# EAGLE design driver_board_one_module_pic_v3_1 (EAGLE 7.6.0)
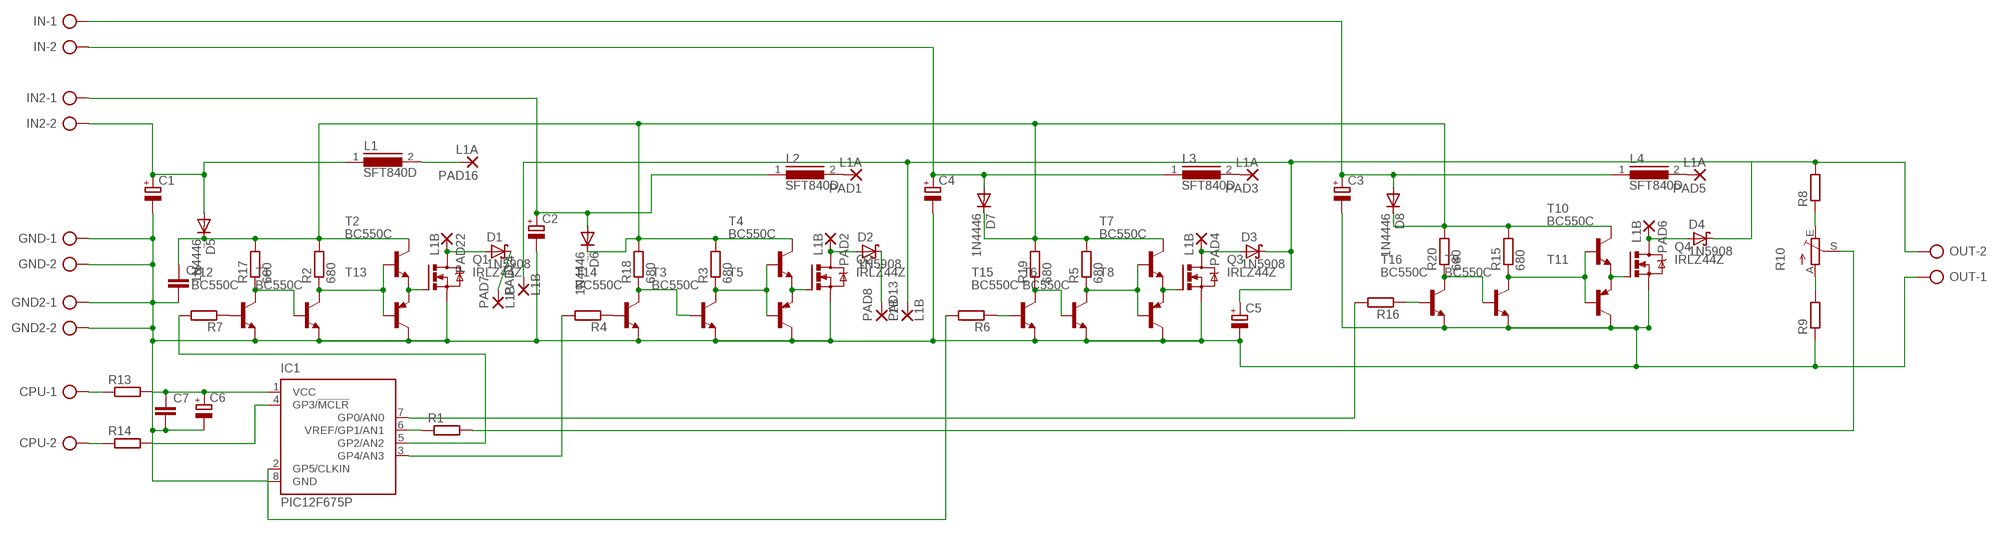
[diagram p0: schematic, sheet 1]

## Parts
C1  CPOL-EUE5-8.5  [E5-8,5]
C2  CPOL-EUE5-8.5  [E5-8,5]
C3  CPOL-EUE5-8.5  [E5-8,5]
C4  CPOL-EUE5-8.5  [E5-8,5]
C5  CPOL-EUE5-8.5  [E5-8,5]
C6  CPOL-EUE5-8.5  [E5-8,5]
C7  C-EUC1206K  [C1206K]
C8  C-EU050-045X075  [C050-045X075]
CPU  AK300/2  [AK300/2]
D1  1N5908  [C4111-15]
D2  1N5908  [C4111-15]
D3  1N5908  [C4111-15]
D4  1N5908  [C4111-15]
D5  1N4446  [DO35-10]
D6  1N4446  [DO35-10]
D7  1N4446  [DO35-10]
D8  1N4446  [DO35-10]
GND  AK300/2  [AK300/2]
GND2  AK300/2  [AK300/2]
IC1  PIC12F675P  [DIL8]
IN  AK300/2  [AK300/2]
IN2  AK300/2  [AK300/2]
L1  SFT840D  [SFT840D]
L2  SFT840D  [SFT840D]
L3  SFT840D  [SFT840D]
L4  SFT840D  [SFT840D]
OUT  AK300/2  [AK300/2]
PAD1  L1A  3,81/1,1  [3,81/1,1]
PAD2  L1B  3,81/1,1  [3,81/1,1]
PAD3  L1A  3,81/1,1  [3,81/1,1]
PAD4  L1B  3,81/1,1  [3,81/1,1]
PAD5  L1A  3,81/1,1  [3,81/1,1]
PAD6  L1B  3,81/1,1  [3,81/1,1]
PAD7  L1B  3,81/1,1  [3,81/1,1]
PAD8  L1B  3,81/1,1  [3,81/1,1]
PAD13  L1B  3,81/1,1  [3,81/1,1]
PAD14  L1B  3,81/1,1  [3,81/1,1]
PAD16  L1A  3,81/1,1  [3,81/1,1]
PAD22  L1B  3,81/1,1  [3,81/1,1]
Q1  IRLZ44Z  [TO220BH]
Q2  IRLZ44Z  [TO220BH]
Q3  IRLZ44Z  [TO220BH]
Q4  IRLZ44Z  [TO220BH]
R1  R-EU_0204/5  [0204/5]
R2  680  R-EU_0207/7  [0207/7]
R3  680  R-EU_0204/5  [0204/5]
R4  R-EU_0207/7  [0207/7]
R5  680  R-EU_0204/5  [0204/5]
R6  R-EU_0207/12  [0207/12]
R7  R-EU_0207/12  [0207/12]
R8  R-EU_0204/5  [0204/5]
R9  R-EU_0204/5  [0204/5]
R10  TRIM_EU-RJ9W  [RJ9W]
R13  R-EU_0204/5  [0204/5]
R14  R-EU_0204/5  [0204/5]
R15  680  R-EU_0204/5  [0204/5]
R16  R-EU_0207/10  [0207/10]
R17  680  R-EU_0204/5  [0204/5]
R18  680  R-EU_0204/5  [0204/5]
R19  680  R-EU_0204/5  [0204/5]
R20  680  R-EU_0204/5  [0204/5]
T1  BC550C  [TO92-EBC]
T2  BC550C  [TO92-EBC]
T3  BC550C  [TO92-EBC]
T4  BC550C  [TO92-EBC]
T5  BC557C-PNP-TO92-EBC  [TO92-EBC]
T6  BC550C  [TO92-EBC]
T7  BC550C  [TO92-EBC]
T8  BC557C-PNP-TO92-EBC  [TO92-EBC]
T9  BC550C  [TO92-EBC]
T10  BC550C  [TO92-EBC]
T11  BC557C-PNP-TO92-EBC  [TO92-EBC]
T12  BC550C  [TO92-EBC]
T13  BC557C-PNP-TO92-EBC  [TO92-EBC]
T14  BC550C  [TO92-EBC]
T15  BC550C  [TO92-EBC]
T16  BC550C  [TO92-EBC]

## Nets
GND: C1.- C2.- C3.- C4.- C5.- C6.- C7.2 C8.2 GND2.1 GND2.2 GND.1 GND.2 IC1.8(GND) OUT.1 Q1.S Q2.S Q3.S Q4.S R9.1 T1.E T3.E T5.C T6.E T8.C T9.E T11.C T12.E T13.C T14.E T15.E T16.E
N$1: Q1.G T2.E T13.E
N$2: IC1.7(GP0/AN0) R16.2
N$3: Q2.G T4.E T5.E
N$4: CPU.1 R13.1
N$5: R9.2 R10.A
N$6: R6.1 T15.B
N$7: CPU.2 R14.1
N$9: D2.A PAD2.1(P) Q2.D
N$10: R8.1 R10.E
N$11: L2.2 PAD1.1(P)
N$12: Q3.G T7.E T8.E
N$13: Q4.G T10.E T11.E
N$14: R7.1 T12.B
N$15: R1.2 R10.S
N$16: R17.1 T1.B T12.C
N$18: D3.A PAD4.1(P) Q3.D
N$19: R4.1 T14.B
N$20: R18.1 T3.B T14.C
N$21: L3.2 PAD3.1(P)
N$22: IC1.5(GP2/AN2) R7.2
N$23: IC1.3(GP4/AN3) R4.2
N$24: IC1.2(GP5/CLKIN) R6.2
N$25: C6.+ C7.1 IC1.1(VCC) R13.2
N$26: IC1.4(GP3/!MCLR) R14.2
N$27: IC1.6(VREF/GP1/AN1) R1.1
N$28: C1.+ D5.A IN2.2 L1.1
N$29: C2.+ D6.A IN2.1 L2.1
N$30: C4.+ D7.A IN.2 L3.1
N$31: D1.C PAD7.1(P)
N$32: R16.1 T16.B
N$33: L1.2 PAD16.1(P)
N$34: D1.A PAD22.1(P) Q1.D
N$35: R2.1 T1.C T2.B T13.B
N$36: D4.A PAD6.1(P) Q4.D
N$37: L4.2 PAD5.1(P)
N$38: R3.1 T3.C T4.B T5.B
N$39: C3.+ D8.A IN.1 L4.1
N$40: R5.1 T6.C T7.B T8.B
N$41: R15.1 T9.C T10.B T11.B
N$42: R19.1 T6.B T15.C
N$43: R20.1 T9.B T16.C
N$44: D2.C PAD8.1(P)
N$45: C8.1 D5.C D6.C D7.C D8.C R2.2 R3.2 R5.2 R15.2 R17.2 R18.2 R19.2 R20.2 T2.C T4.C T7.C T10.C
N$46: C5.+ D3.C D4.C OUT.2 PAD13.1(P) PAD14.1(P) R8.2

## Library data of the parts
C1-C6 = rcl:CPOL-EU: POLARIZED CAPACITOR, European symbol
C7 C8 = rcl:C-EU: CAPACITOR, European symbol
CPU GND GND2 IN IN2 OUT = con-ptr500:AK300/2: CONNECTOR; OC_FARNELL: unknown; OC_NEWARK: unknown
D1-D4 = diode:1N5908: DIODE schottky
D5-D8 = diode:1N4446: DIODE high speed (Philips)
IC1 = microchip:PIC12F675: 8-Pin FLASH-Based 8-Bit CMOS Microcontroller Precision Internal 4 MHz oscillator factory calibrated to ±1% Low Power Features: Standby Current: - 1 nA @ 2.0V, typical Operating Current: - 8.5µA @ 32 kHz, 2.0V, typical - 100µA @ 1 MHz, 2.0V, typical Watchdog Timer Current: - 300 nA @ 2.0V, typical Timer1 oscillator current: - 4µA @ 32 kHz, 2.0V, typical Analog-to-Digital Converter module: - 10-bit resolution - Programmable 4-channel input - Voltage reference input Source: http://www.microchip.com .. 41190E.pdf; MF: MICROCHIP; MPN: PIC12F675-E/P; OC_FARNELL: 9759018; OC_NEWARK: 92C4340
L1-L4 = inductors:SFT840D: INDUCTOR
PAD1-PAD8 PAD13 PAD14 PAD16 PAD22 = wirepad:3,81/1,1: THROUGH-HOLE PAD
Q1-Q4 = transistor-power:IRLZ44Z: N-Channel HEXFET® Power MOSFET Logic Level AUTOMOTIVE MOSFET Source: http://www.irf.com/product-info/datasheets/data/irlz44zpbf.pdf
R1-R9 R13-R15 R17-R20 = resistor:R-EU_: RESISTOR, European symbol
R10 = pot:TRIM_EU-: POTENTIOMETER
R16 = rcl:R-EU_: RESISTOR, European symbol
T1-T4 T6 T7 T9 T10 T12 T14-T16 = transistor-npn:BC550*: NPN Transistor
T5 T8 T11 T13 = transistor:*-PNP-: PNP Transistror

## Board
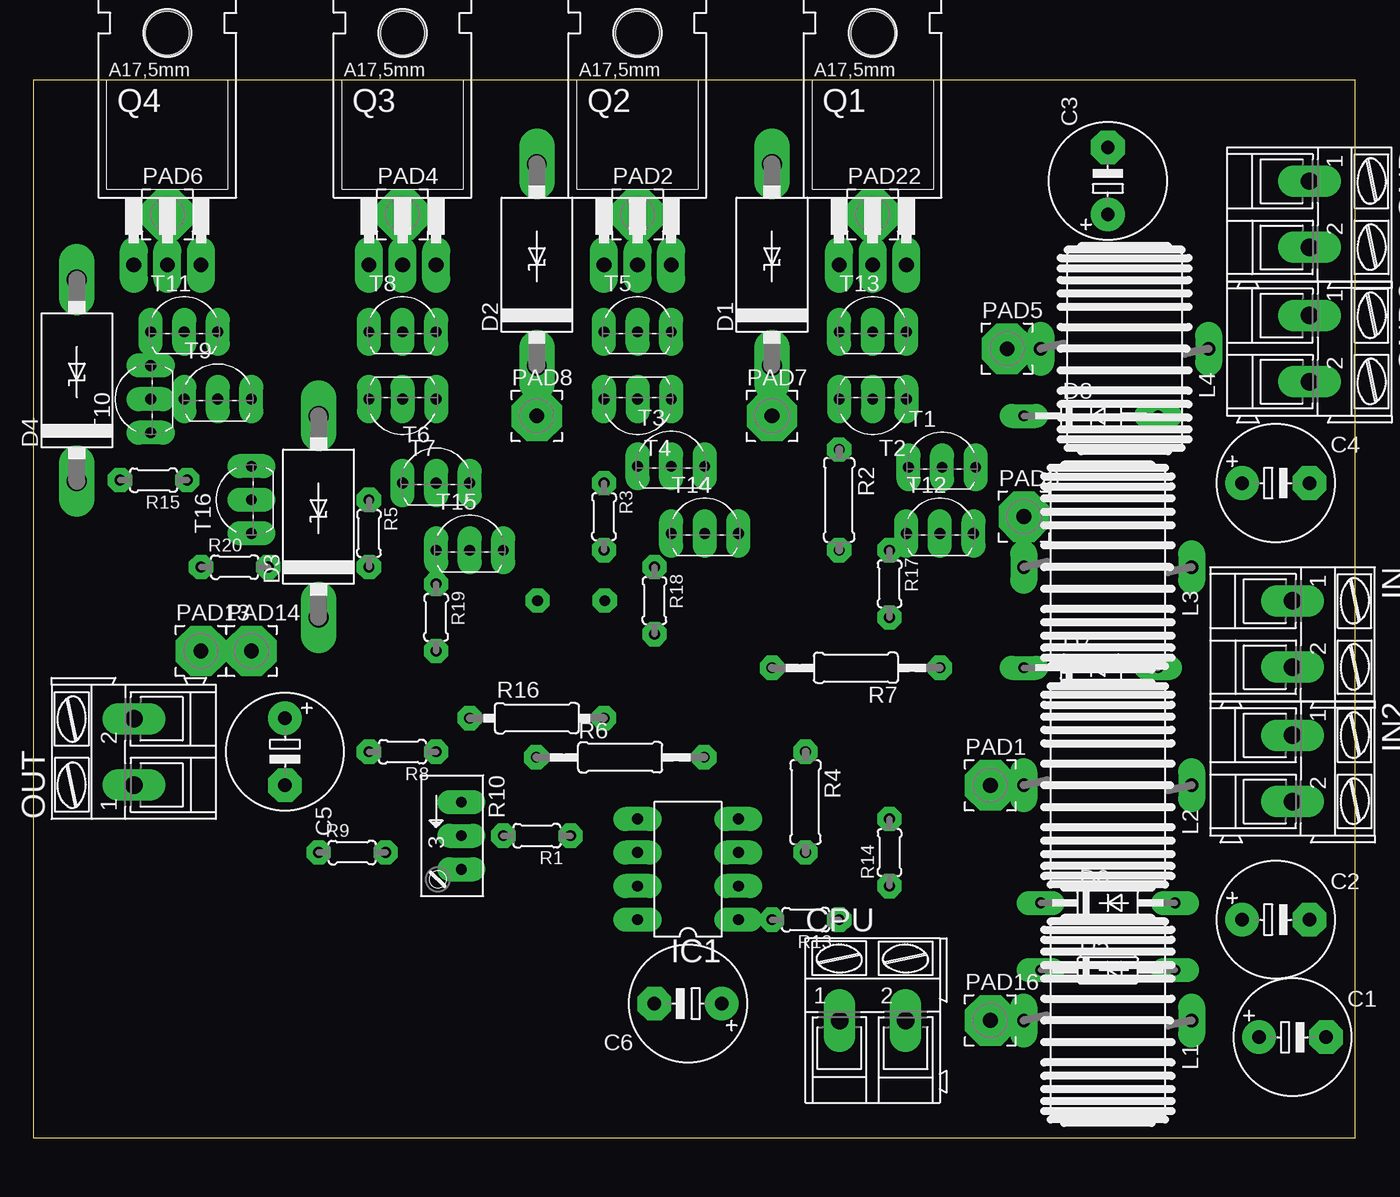
[diagram p1: board, top side]
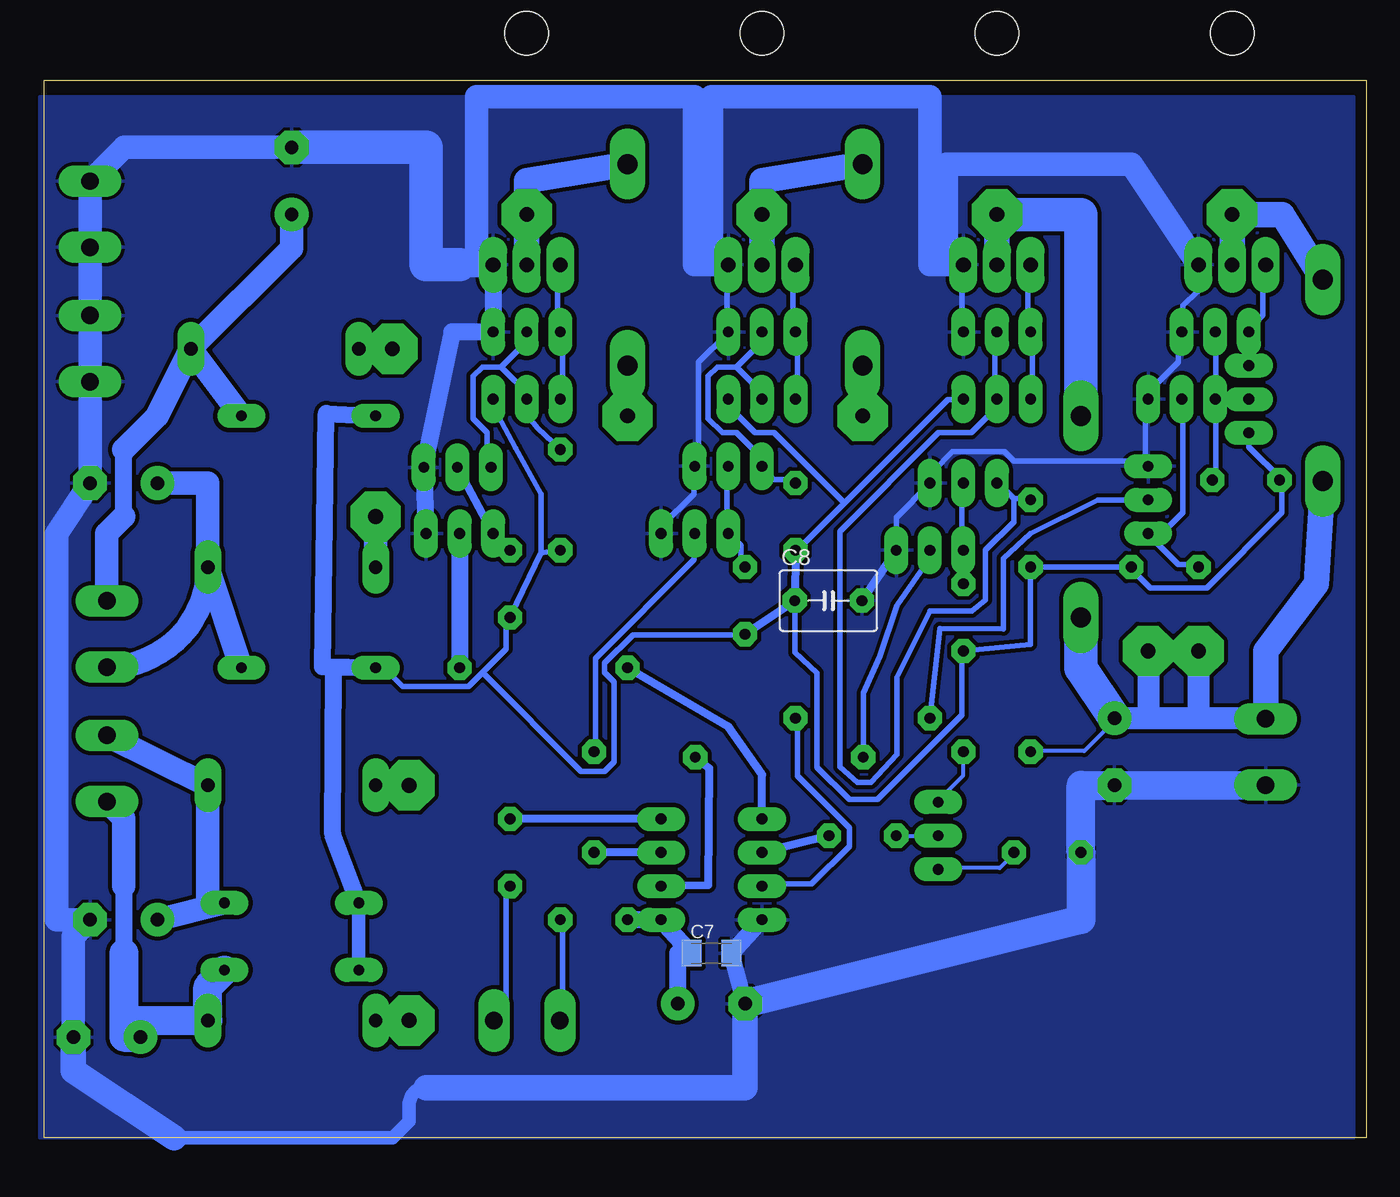
[diagram p2: board, bottom side, seen from below]

Size 100 x 80 mm. Coordinates in mm from the lower left corner, seen from the top.
Outline: 0,0 100,0 100,80 0,80 0,0
Copper layers (1*16): Top 0.035mm / dielectric 1.5mm / Bottom 0.035mm
Design rules "default *": minimum track width 16mil, minimum drill 24mil, track to track 12mil, track to pad 12mil, pad to pad 8mil, via to via 8mil, smd to smd 8mil, copper to edge 0mil, drill to drill 8mil, minimum pad ring 20mil, minimum via ring 8mil, stop-mask expansion 4mil, vias tented up to drill 0mil, thermal gap 10mil

### Footprints (pad centres in the part's own frame; a part is rotated, then mirrored left to right if it is on the bottom)
E5-8,5 = drill 1.016 pad 2.54: + -2.54,0 | drill 1.016 pad 2.54 octagon: - 2.54,0
C1206K = smd 1.5 x 2: 1 -1.5,0; 2 1.5,0
C050-045X075 = drill 0.813 octagon: 1 -2.54,0; 2 2.54,0
AK300/2 = drill 1.321 long: 1 -2.515,0; 2 2.489,0
C4111-15 = drill 1.499 long: A 7.62,0; C -7.62,0
DO35-10 = drill 0.813 long: A 5.08,0; C -5.08,0
DIL8 = drill 0.813 long: 1 -3.81,-3.81; 2 -1.27,-3.81; 3 1.27,-3.81; 4 3.81,-3.81; 5 3.81,3.81; 6 1.27,3.81; 7 -1.27,3.81; 8 -3.81,3.81
SFT840D = drill 1.016 long: 1 -6.35,0; 2 6.35,0
3,81/1,1 = drill 1.118 pad 3.81 octagon: 1 0,0
TO220BH = drill 1.118 long: D 0,-6.35; G -2.54,-6.35; S 2.54,-6.35 | hole 3.302: 0,11.176
0204/5 = drill 0.813 octagon: 1 -2.54,0; 2 2.54,0
0207/7 = drill 0.813 octagon: 1 -3.81,0; 2 3.81,0
0207/12 = drill 0.813 octagon: 1 -6.35,0; 2 6.35,0
RJ9W = drill 0.813 long: A 2.54,0.635; E -2.54,0.635; S 0,0.635
0207/10 = drill 0.813 octagon: 1 -5.08,0; 2 5.08,0
TO92-EBC = drill 0.813 long: B 0,-1.27; C -2.54,-1.27; E 2.54,-1.27
TO92-EBC' = drill 0.813 long: B 0,-1.27; C 2.54,-1.27; E -2.54,-1.27

### Placement (x,y rotation side)
C1  95.25,7.62 0 top
C2  93.98,16.51 0 top
C3  81.28,72.39 90 top
C4  93.98,49.53 0 top
C5  19.05,29.21 270 top
C6  49.53,10.16 180 top
C7  49.53,13.97 0 bottom
C8  40.69,40.64 0 bottom
CPU  63.5,8.89 0 top
D1  55.88,66.04 90 top
D2  38.1,66.04 90 top
D3  21.59,46.99 90 top
D4  3.31,57.3 90 top
D5  81.28,12.7 0 top
D6  81.28,17.78 0 top
D7  80.01,35.56 0 top
D8  80.01,54.61 0 top
GND  96.52,69.85 270 top
GND2  96.52,59.69 270 top
IC1  49.53,20.32 90 top
IN  95.25,38.1 270 top
IN2  95.25,27.94 270 top
L1  81.28,8.89 180 top
L2  81.28,26.67 180 top
L3  81.28,43.18 180 top
L4  82.55,59.69 180 top
OUT  7.62,29.21 90 top
PAD1  72.39,26.67 0 top
PAD2  45.72,69.85 0 top
PAD3  74.93,46.99 0 top
PAD4  27.94,69.85 0 top
PAD5  73.66,59.69 0 top
PAD6  10.16,69.85 0 top
PAD7  55.88,54.61 0 top
PAD8  38.1,54.61 0 top
PAD13  12.7,36.83 0 top
PAD14  16.51,36.83 0 top
PAD16  72.39,8.89 0 top
PAD22  63.5,69.85 0 top
Q1  63.5,72.39 0 top
Q2  45.72,72.39 0 top
Q3  27.94,72.39 0 top
Q4  10.16,72.39 0 top
R1  38.1,22.86 180 top
R2  60.96,48.26 270 top
R3  43.18,46.99 270 top
R4  58.42,25.4 270 top
R5  25.4,45.72 270 top
R6  44.4,28.79 0 top
R7  62.23,35.56 180 top
R8  27.94,29.21 180 top
R9  24.13,21.59 0 top
R10  31.75,22.86 270 top
R13  58.42,16.51 180 top
R14  64.77,21.59 90 top
R15  9.11,49.75 180 top
R16  38.1,31.75 0 top
R17  64.77,41.91 270 top
R18  46.99,40.64 270 top
R19  30.48,39.37 270 top
R20  15.24,43.18 0 top
T1  68.75,51.99 0 top
T2  63.5,54.61 180 top
T3  48.26,52.07 0 top
T4  45.72,54.61 180 top
T5  [TO92-EBC']  45.72,62.23 0 top
T6  30.48,50.8 0 top
T7  27.94,54.61 180 top
T8  [TO92-EBC']  27.94,62.23 0 top
T9  13.97,57.15 0 top
T10  7.62,55.88 90 top
T11  [TO92-EBC']  11.43,62.23 0 top
T12  68.58,46.99 0 top
T13  [TO92-EBC']  63.5,62.23 0 top
T14  50.8,46.99 0 top
T15  33.02,45.72 0 top
T16  15.24,48.26 90 top

### Tracks (layer width: path | path; a pad name or v marks a point on that pad's centre or on a via)
GND
  Bottom 0.305: 12.75,63.96 Q4.S
  Bottom 0.406: Q4.S 12.8,64.01 13.87,62.94 13.87,61.16 T11.C 14.22,60.81 14.22,58.67 16.71,56.19 T9.E 16.71,55.83 16.71,51.21 | 16.71,51.21 16.71,50.85 T16.E 16.71,51.21 | 16.71,51.21 26.67,51.21 27.38,51.92 31.29,51.92 32.72,50.49 32.72,49.78 T6.E 33.07,49.43 35.56,46.94 T15.E | T14.E 53.34,46.23 50.85,48.72 50.85,50.49 T3.E 50.49,50.85 50.49,58.67 48.36,60.81 T5.C 48.36,61.16 48.36,65.43 Q2.S | T8.C 30.58,61.16 30.58,65.43 Q3.S
  Bottom 0.61: T15.E C8.2
  Bottom 1.016: 71.12,3.81 arc-90 72.39,2.54 72.39,1.27 73.66,0 90.17,0
  Bottom 1.27: C6.- C7.2 IC1.8 | Q1.S T13.C 69.16,60.95 T1.E T12.E
  Bottom 1.778: Q4.S 17.78,73.66 31.75,73.66 31.75,66.04 Q3.S 33.02,66.04 33.02,78.74 49.53,78.74 49.53,66.04 Q2.S 50.8,66.04 50.8,78.74 67.31,78.74 67.31,66.04 | C3.- 93.95,74.93 GND.1 GND.2 GND2.1 GND2.2 C4.- 99.06,45.72 99.06,16.51 C2.- 97.79,15.24 C1.-
  Bottom 1.93: Q1.S 67.31,66.04 68.58,66.04 | C6.- 46.99,3.81 71.12,3.81 | 90.17,0 97.79,5.08 C1.-
  Bottom 2.184: C6.- 21.59,16.51 R9.1 21.59,26.67 C5.- OUT.1
  Bottom 2.54: 68.58,66.04 71.12,66.04 71.12,74.93 C3.-
  pour Bottom (isolate 0.305): 0.96,78.74 0.96,0 100.33,0 100.33,78.74
N$1
  Bottom 0.406: T2.E 60.81,56.19 60.81,60.81 T13.E 61.16,61.16 61.16,65.79 Q1.G
N$2
  Bottom 0.406: R16.2 43.03,31.65 43.03,27.38 39.12,23.47 39.12,22.05 41.96,19.2 45.52,19.2 IC1.7
N$3
  Bottom 0.406: T4.E 43.03,56.19 43.03,60.81 T5.E 43.38,61.16 43.38,65.79 Q2.G
N$4
  Bottom 0.406: R13.1 60.81,16.36 60.81,8.89 CPU.1
N$5
  Bottom 0.305: R10.A 32.31,20.42 27.74,20.42 26.82,21.34 R9.2
N$6
  Bottom 0.406: R6.1 38.05,29.38 38.05,33.66 36.79,36.47 35.5,40.28 33.07,43.74 33.07,44.45 T15.B
N$7
  Bottom 0.305: 64.92,10.06 65.84,9.14 CPU.2 | 64.92,18.9 R14.1
  Bottom 0.406: R14.1 65.08,18.85 65.08,9.96 CPU.2
N$9
  Bottom 1.93: D2.A 45.72,72.39 PAD2.1 Q2.D
N$10
  Bottom 0.305: R8.1 30.48,27.43 32.31,25.6 R10.E
N$11
  Bottom 1.778: PAD1.1 L2.2
N$12
  Bottom 0.406: T7.E 25.25,56.19 25.25,60.81 T8.E 25.6,61.16 25.6,65.79 Q3.G
N$13
  Bottom 0.406: T10.E T11.E 8.89,61.16 7.82,62.23 7.82,65.79 Q4.G
N$14
  Bottom 1.27: T12.B R7.1
N$15
  Bottom 0.305: R1.2 R10.S
N$16
  Bottom 0.305: 64.92,44.5 R17.1
  Bottom 0.406: R17.1 65.08,44.45 66.14,45.52 T12.C
  Bottom 0.61: T12.C T1.B
N$18
  Bottom 1.93: Q3.D PAD4.1
  Bottom 2.54: D3.A 21.59,69.85 PAD4.1
N$19
  Bottom 0.406: T14.B 50.85,45.52 50.85,43.74 58.32,36.27 58.32,29.52 R4.1
N$20
  Bottom 0.406: R18.1 47.3,43.38 47.3,44.81 48.01,45.52 T14.C 48.36,45.87 48.36,50.49 T3.B
N$21
  Bottom 1.778: L3.2 PAD3.1
N$22
  Bottom 0.61: IC1.5 45.71,27.5 48.23,31.1 R7.2
N$23
  Bottom 0.61: IC1.3 R4.2
N$24
  Bottom 0.61: IC1.2 49.77,19.14 49.7,27.96 R6.2
N$25
  Bottom 1.27: R13.2 IC1.1 C7.1 52.07,13.97 C6.+
N$26
  Bottom 0.61: IC1.4 R14.2
N$27
  Bottom 0.61: R1.1 IC1.6
N$28
  Bottom 1.27: 93.98,19.05 93.98,13.97
  Bottom 1.778: IN2.2 93.98,24.18 93.98,19.05
  Bottom 2.184: 93.98,13.97 93.98,7.62 C1.+ 92.71,8.89 L1.1 87.63,11.43 D5.A
N$29
  Bottom 1.778: IN2.1 L2.1 87.63,17.78 D6.A C2.+
N$30
  Bottom 1.778: C4.+ 87.63,49.53 L3.1 | IN.2 95.2,35.61 arc-90 L3.1 | D7.A L3.1
N$31
  Bottom 1.27: D1.C PAD7.1
N$32
  Bottom 0.406: T16.B 20.32,48.26 25.4,45.72 27.46,43.83 27.46,38.51 32.25,38.53 R16.1
N$33
  Bottom 1.778: PAD16.1 L1.2
N$34
  Bottom 1.93: D1.A 63.5,72.39 PAD22.1 Q1.D
N$35
  Bottom 0.406: R2.1 62.69,53.68 63.34,54.49 63.3,55.12 63.3,55.83 T2.B 63.3,56.19 65.43,58.32 | 65.43,58.32 66.85,58.32 67.56,57.61 67.56,54.41 66.5,53.34 66.5,50.85 T1.C | 65.43,58.32 63.65,60.1 63.65,60.81 T13.B
N$36
  Bottom 1.93: Q4.D PAD6.1 6.35,69.85 D4.A
N$37
  Bottom 0.305: 73.76,59.74 PAD5.1
  Bottom 1.778: 73.76,59.74 L4.2
N$38
  Bottom 0.305: 43.28,49.68 R3.1 | 45.72,50.6 T3.C
  Bottom 0.406: R3.1 43.38,49.78 44.81,49.78 45.52,50.49 T3.C 45.87,50.85 45.87,51.56 47.65,53.34 48.72,53.34 49.78,54.41 49.78,57.61 49.07,58.32 47.65,58.32 | 47.65,58.32 45.52,56.19 T4.B | 47.65,58.32 45.87,60.1 45.87,60.81 T5.B
N$39
  Bottom 1.27: 93.98,46.99 93.98,52.07
  Bottom 1.778: C3.+ 81.28,67.31 L4.1 | IN.1 95.25,45.72 93.98,46.99 | 93.98,52.07 91.44,54.61 L4.1 | L4.1 D8.A
N$40
  Bottom 0.406: 26.67,48.36 25.6,48.36 R5.1 | 26.67,48.36 27.74,49.43 T6.C | 26.67,48.36 26.67,46.58 28.8,44.45 28.8,40.68 29.82,39.87 33.03,39.87 35.51,34.81 35.51,29.01 37.49,26.88 38.5,26.88 39.83,28.05 39.83,45.87 32.36,53.34 29.87,53.34 28.09,55.12 28.09,55.83 T7.B 28.09,56.19 28.09,60.81 T8.B
N$41
  Bottom 0.406: 11.38,55.83 8.89,55.83 T10.B | 11.38,55.83 11.38,49.78 R15.1 | 11.38,55.83 T9.C 11.38,56.19 11.38,60.81 T11.B
N$42
  Bottom 0.406: 30.58,44.45 30.58,41.96 R19.1 | 30.58,44.45 30.58,49.43 T6.B | 30.58,44.45 T15.C
N$43
  Bottom 0.406: 16,45.16 16.36,45.52 T16.C 16,45.16 | 16,45.16 14.22,43.38 12.8,43.38 R20.1 | 16,45.16 13.87,47.3 13.87,55.83 T9.B
N$44
  Bottom 1.27: D2.C PAD8.1
N$45
  Bottom 0.406: C8.1 43.23,36.73 41.55,35.15 41.55,28.04 39.12,25.6 36.98,25.6 30.58,32 30.58,36.63 R19.2 25.43,37.32 R5.2 R20.2 17.78,43.03 16.36,41.6 12.09,41.6 6.4,47.3 6.4,49.43 R15.2 6.4,49.78 8.89,52.27 T10.C | 62.43,44.3 62.28,44.3 R2.2 | 62.43,44.3 64.72,39.47 R17.2 65.08,39.12 65.08,36.98 66.85,35.2 | 62.43,44.3 62.43,48.72 64.34,52.2 65.68,54.65 T2.C | 66.85,35.2 67.92,34.14 72.9,34.14 74.32,35.56 D7.C | 39.47,48.01 43.03,44.45 R3.2 | 39.47,48.01 31.65,55.83 30.58,55.83 T7.C | 39.47,48.01 44.81,53.34 46.23,53.34 48.01,55.12 48.01,55.83 T4.C | 66.85,35.2 59.38,27.74 57.61,27.74 56.9,28.45 56.9,34.49 57.61,35.2 57.61,35.92 55.47,38.05 47.3,38.05 R18.2
  Bottom 0.61: R3.2 C8.1 R18.2
  Bottom 1.016: D5.C D6.C
  Bottom 1.27: D6.C 78.17,22.97 78.11,35.61 D7.C 78.94,35.63 78.66,54.79 D8.C
N$46
  Bottom 0.305: R8.2 25.3,29.26 21.34,29.26 19.51,31.09 C5.+
  Bottom 1.676: 6.35,31.8 OUT.2 8.89,31.75 12.7,31.75 | PAD13.1 12.7,31.75 | PAD14.1 16.51,31.75 | 16.51,31.75 12.7,31.75 | C5.+ 16.51,31.75
  Bottom 1.93: D4.C 3.81,41.91 7.62,36.83 OUT.2
  Bottom 2.54: D3.C 21.59,35.56 C5.+